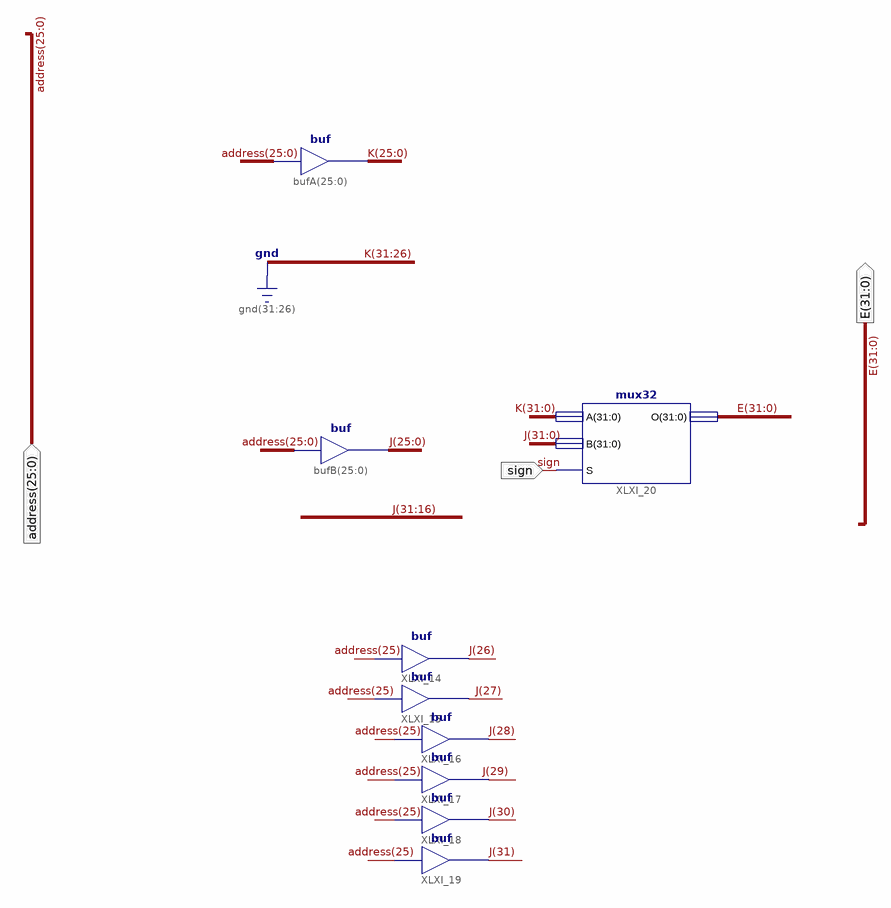
[diagram p0: schematic sheet 1]
// Xilinx ISE schematic expantion26.sch (artix7) as structural Verilog: 9 symbols, 3 ports
module expantion26 (
  input  [25:0] address,
  input  sign,
  output [31:0] E
);

  wire [25:0] K;
  wire [31:0] J;

  assign K = address;  // buf bufA[25..0], 26 bits wide
  assign J[25:0] = address;  // buf bufB[25..0], 26 bits wide
  buf XLXI_14 (J[26], address[25]);
  buf XLXI_15 (J[27], address[25]);
  buf XLXI_16 (J[28], address[25]);
  buf XLXI_17 (J[29], address[25]);
  buf XLXI_18 (J[30], address[25]);
  buf XLXI_19 (J[31], address[25]);
  mux32 XLXI_20 (.A({{6{1'b0}}, K}), .B(J), .S(sign), .O(E));
endmodule
